# Altium schematic sheet NetworkSwitch.SchDoc: Main Flight Computer Ethernet Switch
size A2; Revision: 1A; SheetNumber: 3; SheetTotal: 7; Organization: Altium Limited; Address1: Matthew Glazer; Address2: Design Engineer
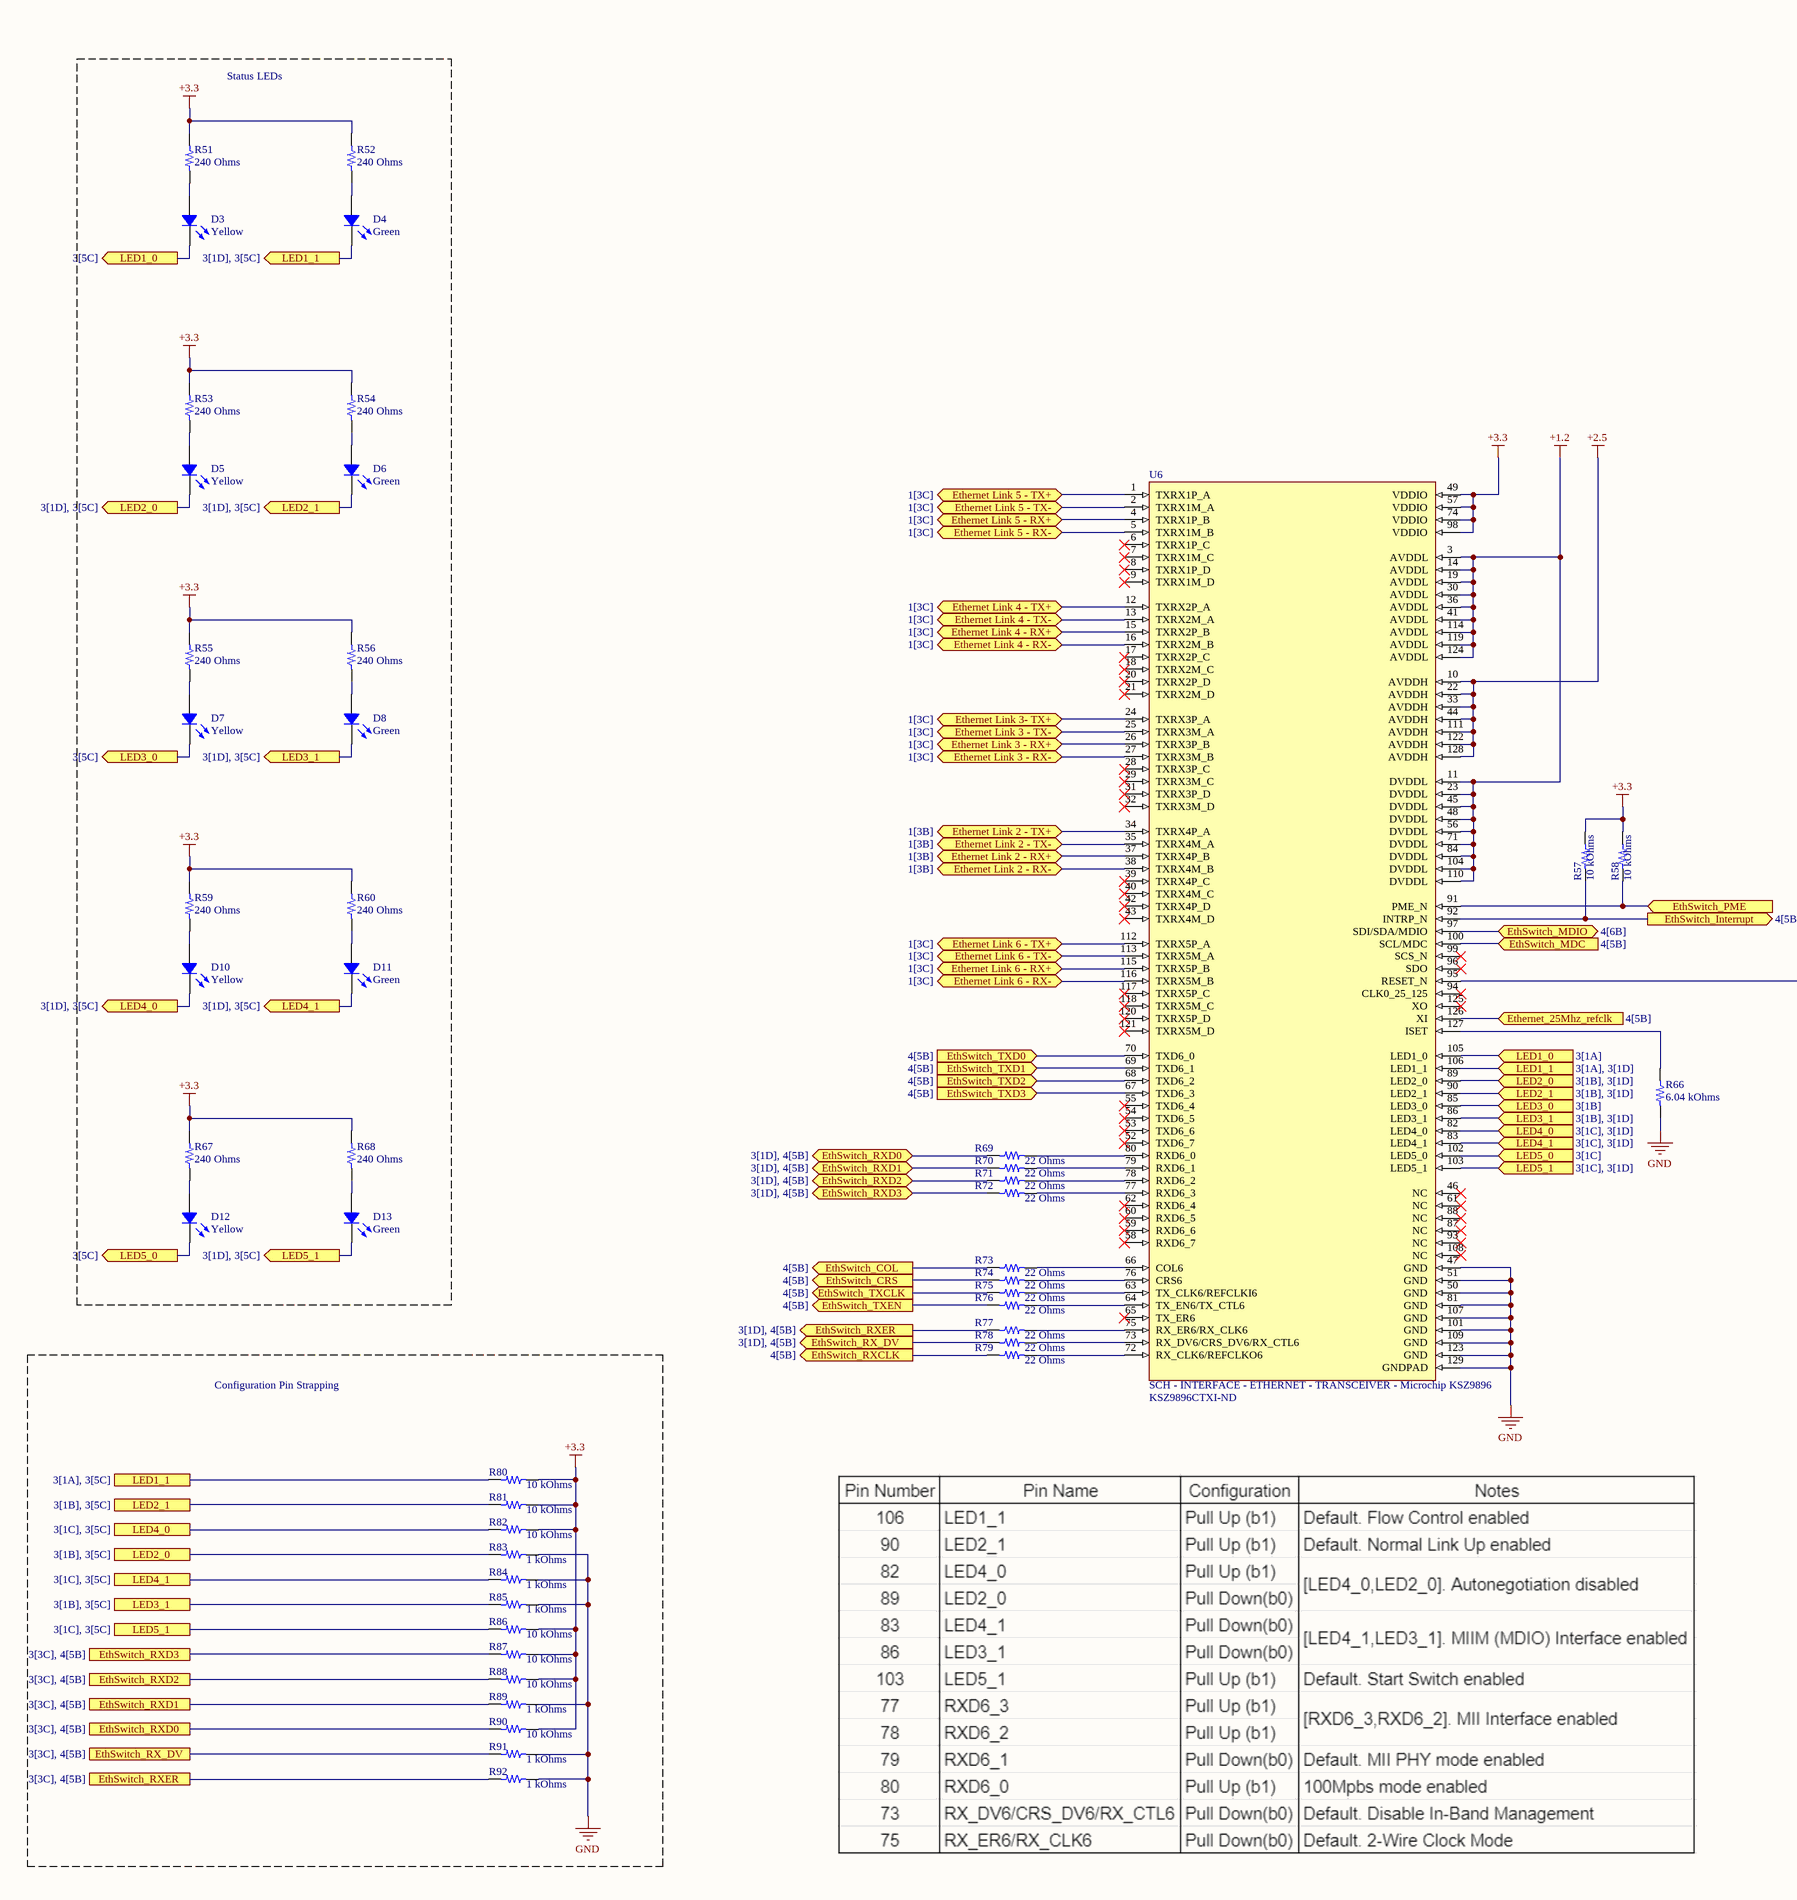
[diagram p0: NetworkSwitch.SchDoc, left]
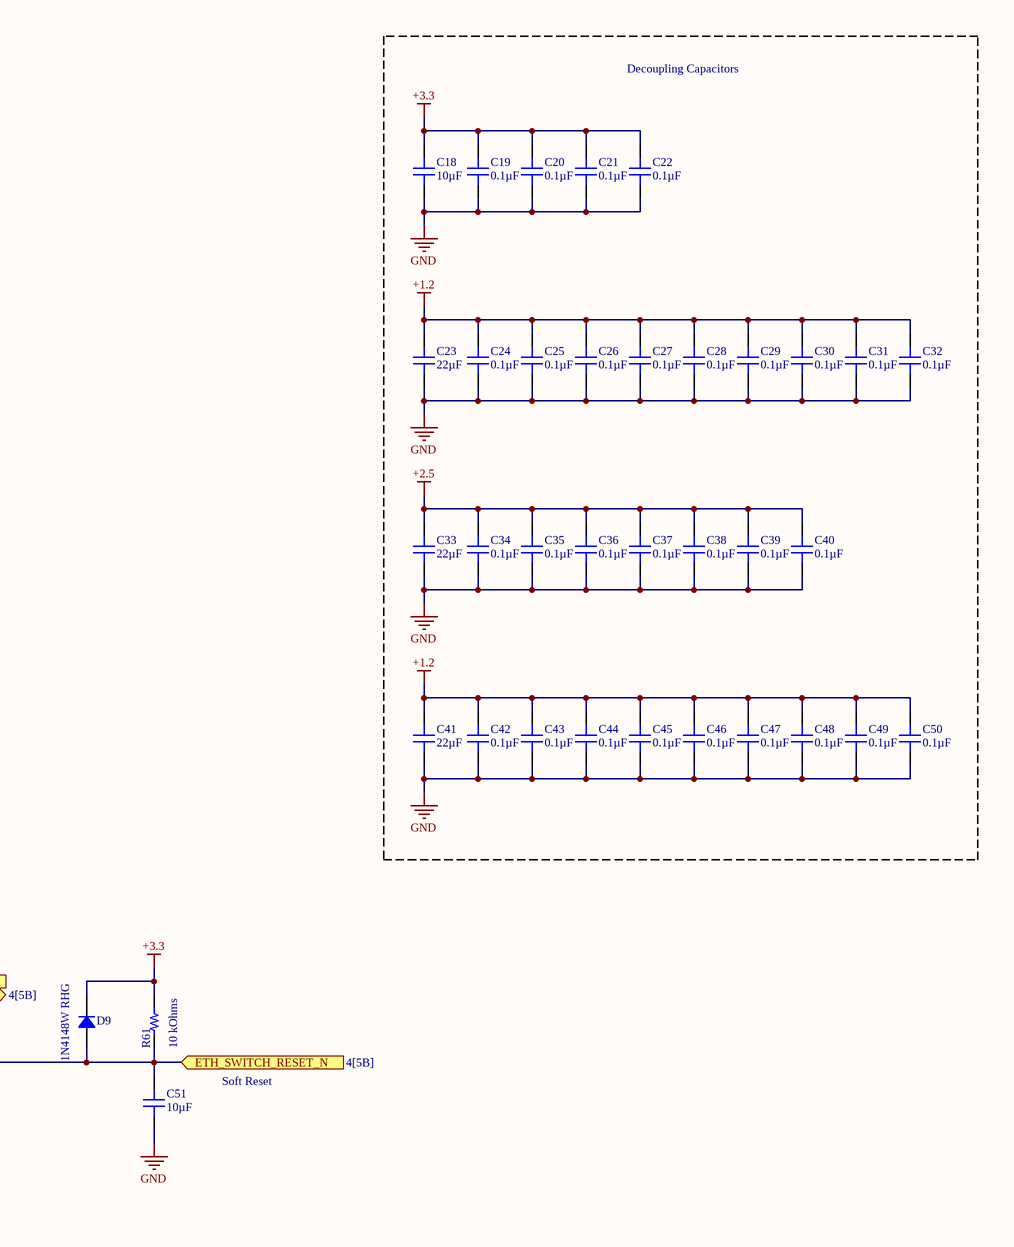
[diagram p1: NetworkSwitch.SchDoc, right]

## Parts
C18  10µF  [CAP 0805_2012]
C19  0.1µF  [CAP 0603_1608]
C20  0.1µF  [CAP 0603_1608]
C21  0.1µF  [CAP 0603_1608]
C22  0.1µF  [CAP 0603_1608]
C23  22µF  [CAP 0805_2012]
C24  0.1µF  [CAP 0603_1608]
C25  0.1µF  [CAP 0603_1608]
C26  0.1µF  [CAP 0603_1608]
C27  0.1µF  [CAP 0603_1608]
C28  0.1µF  [CAP 0603_1608]
C29  0.1µF  [CAP 0603_1608]
C30  0.1µF  [CAP 0603_1608]
C31  0.1µF  [CAP 0603_1608]
C32  0.1µF  [CAP 0603_1608]
C33  22µF  [CAP 0805_2012]
C34  0.1µF  [CAP 0603_1608]
C35  0.1µF  [CAP 0603_1608]
C36  0.1µF  [CAP 0603_1608]
C37  0.1µF  [CAP 0603_1608]
C38  0.1µF  [CAP 0603_1608]
C39  0.1µF  [CAP 0603_1608]
C40  0.1µF  [CAP 0603_1608]
C41  22µF  [CAP 0805_2012]
C42  0.1µF  [CAP 0603_1608]
C43  0.1µF  [CAP 0603_1608]
C44  0.1µF  [CAP 0603_1608]
C45  0.1µF  [CAP 0603_1608]
C46  0.1µF  [CAP 0603_1608]
C47  0.1µF  [CAP 0603_1608]
C48  0.1µF  [CAP 0603_1608]
C49  0.1µF  [CAP 0603_1608]
C50  0.1µF  [CAP 0603_1608]
C51  10µF  [CAP 0805_2012]
D3  Yellow  [LED 0603_1608 YELLOW]
D4  Green  [LED 0603_1608 GREEN]
D5  Yellow  [LED 0603_1608 YELLOW]
D6  Green  [LED 0603_1608 GREEN]
D7  Yellow  [LED 0603_1608 YELLOW]
D8  Green  [LED 0603_1608 GREEN]
D9  1N4148W RHG  [SOD123F]
D10  Yellow  [LED 0603_1608 YELLOW]
D11  Green  [LED 0603_1608 GREEN]
D12  Yellow  [LED 0603_1608 YELLOW]
D13  Green  [LED 0603_1608 GREEN]
R51  240 Ohms  [RES 0603_1608]
R52  240 Ohms  [RES 0603_1608]
R53  240 Ohms  [RES 0603_1608]
R54  240 Ohms  [RES 0603_1608]
R55  240 Ohms  [RES 0603_1608]
R56  240 Ohms  [RES 0603_1608]
R57  10 kOhms  [RES 0603_1608]
R58  10 kOhms  [RES 0603_1608]
R59  240 Ohms  [RES 0603_1608]
R60  240 Ohms  [RES 0603_1608]
R61  10 kOhms  [RES 0603_1608]
R66  6.04 kOhms  [RES 0603_1608]
R67  240 Ohms  [RES 0603_1608]
R68  240 Ohms  [RES 0603_1608]
R69  22 Ohms  [RES 0603_1608]
R70  22 Ohms  [RES 0603_1608]
R71  22 Ohms  [RES 0603_1608]
R72  22 Ohms  [RES 0603_1608]
R73  22 Ohms  [RES 0603_1608]
R74  22 Ohms  [RES 0603_1608]
R75  22 Ohms  [RES 0603_1608]
R76  22 Ohms  [RES 0603_1608]
R77  22 Ohms  [RES 0603_1608]
R78  22 Ohms  [RES 0603_1608]
R79  22 Ohms  [RES 0603_1608]
R80  10 kOhms  [RES 0603_1608]
R81  10 kOhms  [RES 0603_1608]
R82  10 kOhms  [RES 0603_1608]
R83  1 kOhms  [RES 0603_1608]
R84  1 kOhms  [RES 0603_1608]
R85  1 kOhms  [RES 0603_1608]
R86  10 kOhms  [RES 0603_1608]
R87  10 kOhms  [RES 0603_1608]
R88  10 kOhms  [RES 0603_1608]
R89  1 kOhms  [RES 0603_1608]
R90  10 kOhms  [RES 0603_1608]
R91  1 kOhms  [RES 0603_1608]
R92  1 kOhms  [RES 0603_1608]
U6  SCH - INTERFACE - ETHERNET - TRANSCEIVER - Microchip KSZ9896  Supplier Part Number 1: KSZ9896CTXI-ND  [PCB - LEADS - QFP - Microchip 128-TQFP]

## Blocks framed on the sheet
Status LEDs: D3-D8 D10-D13 R51-R56 R59 R60 R67 R68
Decoupling Capacitors: C18-C50
Configuration Pin Strapping: R80-R92

## Ports
ETH_SWITCH_RESET_N (in, see 4[5B]), Ethernet Link 2 - RX+ (bidir, see 1[3B]), Ethernet Link 2 - RX- (bidir, see 1[3B]), Ethernet Link 2 - TX+ (bidir, see 1[3B]), Ethernet Link 2 - TX- (bidir, see 1[3B]), Ethernet Link 3 - RX+ (bidir, see 1[3C]), Ethernet Link 3 - RX- (bidir, see 1[3C]), Ethernet Link 3 - TX- (bidir, see 1[3C]), Ethernet Link 3- TX+ (bidir, see 1[3C]), Ethernet Link 4 - RX+ (bidir, see 1[3C]), Ethernet Link 4 - RX- (bidir, see 1[3C]), Ethernet Link 4 - TX+ (bidir, see 1[3C]), Ethernet Link 4 - TX- (bidir, see 1[3C]), Ethernet Link 5 - RX+ (bidir, see 1[3C]), Ethernet Link 5 - RX- (bidir, see 1[3C]), Ethernet Link 5 - TX+ (bidir, see 1[3C]), Ethernet Link 5 - TX- (bidir, see 1[3C]), Ethernet Link 6 - RX+ (bidir, see 1[3C]), Ethernet Link 6 - RX- (bidir, see 1[3C]), Ethernet Link 6 - TX+ (bidir, see 1[3C]), Ethernet Link 6 - TX- (bidir, see 1[3C]), Ethernet_25Mhz_refclk (in, see 4[5B]), EthSwitch_COL (out, see 4[5B]), EthSwitch_CRS (out, see 4[5B]), EthSwitch_Interrupt (out, see 4[5B]), EthSwitch_MDC (in, see 4[5B]), EthSwitch_MDIO (bidir, see 4[6B]), EthSwitch_PME (in), EthSwitch_RX_DV (out, see 3[1D], 4[5B]), EthSwitch_RX_DV (see 3[3C], 4[5B]), EthSwitch_RXCLK (out, see 4[5B]), EthSwitch_RXD0 (bidir, see 3[1D], 4[5B]), EthSwitch_RXD0 (see 3[3C], 4[5B]), EthSwitch_RXD1 (bidir, see 3[1D], 4[5B]), EthSwitch_RXD1 (see 3[3C], 4[5B]), EthSwitch_RXD2 (bidir, see 3[1D], 4[5B]), EthSwitch_RXD2 (see 3[3C], 4[5B]), EthSwitch_RXD3 (bidir, see 3[1D], 4[5B]), EthSwitch_RXD3 (see 3[3C], 4[5B]), EthSwitch_RXER (out, see 3[1D], 4[5B]), EthSwitch_RXER (see 3[3C], 4[5B]), EthSwitch_TXCLK (out, see 4[5B]), EthSwitch_TXD0 (in, see 4[5B]), EthSwitch_TXD1 (in, see 4[5B]), EthSwitch_TXD2 (in, see 4[5B]), EthSwitch_TXD3 (in, see 4[5B]), EthSwitch_TXEN (out, see 4[5B]), LED1_0 (in, see 3[1A]), LED1_0 (out, see 3[5C]), LED1_1 (in, see 3[1A], 3[1D]), LED1_1 (out, see 3[1D], 3[5C]), LED1_1 (see 3[1A], 3[5C]), LED2_0 (in, see 3[1B], 3[1D]), LED2_0 (out, see 3[1D], 3[5C]), LED2_0 (see 3[1B], 3[5C]), LED2_1 (in, see 3[1B], 3[1D]), LED2_1 (out, see 3[1D], 3[5C]), LED2_1 (see 3[1B], 3[5C]), LED3_0 (in, see 3[1B]), LED3_0 (out, see 3[5C]), LED3_1 (in, see 3[1B], 3[1D]), LED3_1 (out, see 3[1D], 3[5C]), LED3_1 (see 3[1B], 3[5C]), LED4_0 (in, see 3[1C], 3[1D]), LED4_0 (out, see 3[1D], 3[5C]), LED4_0 (see 3[1C], 3[5C]), LED4_1 (in, see 3[1C], 3[1D]), LED4_1 (out, see 3[1D], 3[5C]), LED4_1 (see 3[1C], 3[5C]), LED5_0 (in, see 3[1C]), LED5_0 (out, see 3[5C]), LED5_1 (in, see 3[1C], 3[1D]), LED5_1 (out, see 3[1D], 3[5C]), LED5_1 (see 3[1C], 3[5C])

## Nets
+1.2: C23.2 C24.2 C25.2 C26.2 C27.2 C28.2 C29.2 C30.2 C31.2 C32.2 C41.2 C42.2 C43.2 C44.2 C45.2 C46.2 C47.2 C48.2 C49.2 C50.2 U6.3(AVDDL) U6.11(DVDDL) U6.14(AVDDL) U6.19(AVDDL) U6.23(DVDDL) U6.30(AVDDL) U6.36(AVDDL) U6.41(AVDDL) U6.45(DVDDL) U6.48(DVDDL) U6.56(DVDDL) U6.71(DVDDL) U6.84(DVDDL) U6.104(DVDDL) U6.110(DVDDL) U6.114(AVDDL) U6.119(AVDDL) U6.124(AVDDL)
+2.5: C33.2 C34.2 C35.2 C36.2 C37.2 C38.2 C39.2 C40.2 U6.10(AVDDH) U6.22(AVDDH) U6.33(AVDDH) U6.44(AVDDH) U6.111(AVDDH) U6.122(AVDDH) U6.128(AVDDH)
+3.3: C18.2 C19.2 C20.2 C21.2 C22.2 D9.2 R51.2 R52.2 R53.2 R54.2 R55.2 R56.2 R57.2 R58.2 R59.2 R60.2 R61.2 R67.2 R68.2 R80.1 R81.1 R82.1 R86.1 R87.1 R88.1 R90.1 U6.49(VDDIO) U6.57(VDDIO) U6.74(VDDIO) U6.98(VDDIO)
GND: C18.1 C19.1 C20.1 C21.1 C22.1 C23.1 C24.1 C25.1 C26.1 C27.1 C28.1 C29.1 C30.1 C31.1 C32.1 C33.1 C34.1 C35.1 C36.1 C37.1 C38.1 C39.1 C40.1 C41.1 C42.1 C43.1 C44.1 C45.1 C46.1 C47.1 C48.1 C49.1 C50.1 C51.1 R66.1 R83.1 R84.1 R85.1 R89.1 R91.1 R92.1 U6.47(GND) U6.50(GND) U6.51(GND) U6.81(GND) U6.101(GND) U6.107(GND) U6.109(GND) U6.123(GND) U6.129(GNDPAD)
ETH_SWITCH_RESET_N: C51.2 D9.1 R61.1 U6.95(RESET_N) ; port ETH_SWITCH_RESET_N
Ethernet Link 2 - RX+: U6.37(TXRX4P_B) ; port Ethernet Link 2 - RX+
Ethernet Link 2 - RX-: U6.38(TXRX4M_B) ; port Ethernet Link 2 - RX-
Ethernet Link 2 - TX+: U6.34(TXRX4P_A) ; port Ethernet Link 2 - TX+
Ethernet Link 2 - TX-: U6.35(TXRX4M_A) ; port Ethernet Link 2 - TX-
Ethernet Link 3 - RX+: U6.26(TXRX3P_B) ; port Ethernet Link 3 - RX+
Ethernet Link 3 - RX-: U6.27(TXRX3M_B) ; port Ethernet Link 3 - RX-
Ethernet Link 3 - TX-: U6.25(TXRX3M_A) ; port Ethernet Link 3 - TX-
Ethernet Link 3- TX+: U6.24(TXRX3P_A) ; port Ethernet Link 3- TX+
Ethernet Link 4 - RX+: U6.15(TXRX2P_B) ; port Ethernet Link 4 - RX+
Ethernet Link 4 - RX-: U6.16(TXRX2M_B) ; port Ethernet Link 4 - RX-
Ethernet Link 4 - TX+: U6.12(TXRX2P_A) ; port Ethernet Link 4 - TX+
Ethernet Link 4 - TX-: U6.13(TXRX2M_A) ; port Ethernet Link 4 - TX-
Ethernet Link 5 - RX+: U6.4(TXRX1P_B) ; port Ethernet Link 5 - RX+
Ethernet Link 5 - RX-: U6.5(TXRX1M_B) ; port Ethernet Link 5 - RX-
Ethernet Link 5 - TX+: U6.1(TXRX1P_A) ; port Ethernet Link 5 - TX+
Ethernet Link 5 - TX-: U6.2(TXRX1M_A) ; port Ethernet Link 5 - TX-
Ethernet Link 6 - RX+: U6.115(TXRX5P_B) ; port Ethernet Link 6 - RX+
Ethernet Link 6 - RX-: U6.116(TXRX5M_B) ; port Ethernet Link 6 - RX-
Ethernet Link 6 - TX+: U6.112(TXRX5P_A) ; port Ethernet Link 6 - TX+
Ethernet Link 6 - TX-: U6.113(TXRX5M_A) ; port Ethernet Link 6 - TX-
Ethernet_25Mhz_refclk: U6.126(XI) ; port Ethernet_25Mhz_refclk
EthSwitch_COL: R73.1 ; port EthSwitch_COL
EthSwitch_CRS: R74.1 ; port EthSwitch_CRS
EthSwitch_Interrupt: R57.1 U6.92(INTRP_N) ; port EthSwitch_Interrupt
EthSwitch_MDC: U6.100(SCL/MDC) ; port EthSwitch_MDC
EthSwitch_MDIO: U6.97(SDI/SDA/MDIO) ; port EthSwitch_MDIO
EthSwitch_PME: R58.1 U6.91(PME_N) ; port EthSwitch_PME
EthSwitch_RX_DV: R78.1 R91.2 ; port EthSwitch_RX_DV
EthSwitch_RXCLK: R79.1 ; port EthSwitch_RXCLK
EthSwitch_RXD0: R69.1 R90.2 ; port EthSwitch_RXD0
EthSwitch_RXD1: R70.1 R89.2 ; port EthSwitch_RXD1
EthSwitch_RXD2: R71.1 R88.2 ; port EthSwitch_RXD2
EthSwitch_RXD3: R72.1 R87.2 ; port EthSwitch_RXD3
EthSwitch_RXER: R77.1 R92.2 ; port EthSwitch_RXER
EthSwitch_TXCLK: R75.1 ; port EthSwitch_TXCLK
EthSwitch_TXD0: U6.70(TXD6_0) ; port EthSwitch_TXD0
EthSwitch_TXD1: U6.69(TXD6_1) ; port EthSwitch_TXD1
EthSwitch_TXD2: U6.68(TXD6_2) ; port EthSwitch_TXD2
EthSwitch_TXD3: U6.67(TXD6_3) ; port EthSwitch_TXD3
EthSwitch_TXEN: R76.1 ; port EthSwitch_TXEN
LED1_0: D3.2 U6.105(LED1_0) ; port LED1_0
LED1_1: D4.2 R80.2 U6.106(LED1_1) ; port LED1_1
LED2_0: D5.2 R83.2 U6.89(LED2_0) ; port LED2_0
LED2_1: D6.2 R81.2 U6.90(LED2_1) ; port LED2_1
LED3_0: D7.2 U6.85(LED3_0) ; port LED3_0
LED3_1: D8.2 R85.2 U6.86(LED3_1) ; port LED3_1
LED4_0: D10.2 R82.2 U6.82(LED4_0) ; port LED4_0
LED4_1: D11.2 R84.2 U6.83(LED4_1) ; port LED4_1
LED5_0: D12.2 U6.102(LED5_0) ; port LED5_0
LED5_1: D13.2 R86.2 U6.103(LED5_1) ; port LED5_1
NetD3_1: D3.1 R51.1
NetD4_1: D4.1 R52.1
NetD5_1: D5.1 R53.1
NetD6_1: D6.1 R54.1
NetD7_1: D7.1 R55.1
NetD8_1: D8.1 R56.1
NetD10_1: D10.1 R59.1
NetD11_1: D11.1 R60.1
NetD12_1: D12.1 R67.1
NetD13_1: D13.1 R68.1
NetR66_2: R66.2 U6.127(ISET)
NetR69_2: R69.2 U6.80(RXD6_0)
NetR70_2: R70.2 U6.79(RXD6_1)
NetR71_2: R71.2 U6.78(RXD6_2)
NetR72_2: R72.2 U6.77(RXD6_3)
NetR73_2: R73.2 U6.66(COL6)
NetR74_2: R74.2 U6.76(CRS6)
NetR75_2: R75.2 U6.63(TX_CLK6/REFCLKI6)
NetR76_2: R76.2 U6.64(TX_EN6/TX_CTL6)
NetR77_2: R77.2 U6.75(RX_ER6/RX_CLK6)
NetR78_2: R78.2 U6.73(RX_DV6/CRS_DV6/RX_CTL6)
NetR79_2: R79.2 U6.72(RX_CLK6/REFCLKO6)

Not connected (* = marked no-connect by the designer): U6 6(TXRX1P_C)* 7(TXRX1M_C)* 8(TXRX1P_D)* 9(TXRX1M_D)* 17(TXRX2P_C)* 18(TXRX2M_C)* 20(TXRX2P_D)* 21(TXRX2M_D)* 28(TXRX3P_C)* 29(TXRX3M_C)* 31(TXRX3P_D)* 32(TXRX3M_D)* 39(TXRX4P_C)* 40(TXRX4M_C)* 42(TXRX4P_D)* 43(TXRX4M_D)* 46(NC)* 52(TXD6_7)* 53(TXD6_6)* 54(TXD6_5)* 55(TXD6_4)* 58(RXD6_7)* 59(RXD6_6)* 60(RXD6_5)* 61(NC)* 62(RXD6_4)* 65(TX_ER6)* 87(NC)* 88(NC)* 93(NC)* 94(CLK0_25_125)* 96(SDO)* 99(SCS_N)* 108(NC)* 117(TXRX5P_C)* 118(TXRX5M_C)* 120(TXRX5P_D)* 121(TXRX5M_D)* 125(XO)*

## Notes on the sheet
- Soft Reset
- Title
- Size:
- Date:
- File:
- A2
- Number:
- Time:
- Revision:
- Sheet
- of

## Library data of the parts
C18 C51 = CC0805KKX5R7BB106: CAP CER 10UF 16V X5R 0805; Manufacturer: Yageo; Tolerance: ±10%; Part Number: CC0805KKX5R7BB106; Value: 10µF; Applications: General Purpose; Capacitance: 10µF; ComponentLink1Description: Datasheet; ComponentLink1URL: https://www.yageo.com/upload/media/product/productsearch/datasheet/mlcc/UPY-GPHC_X5R_4V-to-50V_25.pdf; ComponentLink2Description: DigiKey Link; ComponentLink2URL: http://digikey.com/product-detail/en/yageo/CC0805KKX5R7BB106/311-1865-1-ND/5195767; Device Package: 0805 (2012 Metric); LastUpdated: 9/2/2020 1:04:30 AM; Lifecycle Status: Active; Minimum Order: 1; Mounting Type: Surface Mount, MLCC; Operating Temperature: -55°C ~ 85°C; Package / Case: 0805 (2012 Metric); Packaging: TapeAndReel; PartId: 8867; Part Status: Active; Price: 0.09; Series: CC; Size / Dimension: 0.079" L x 0.049" W (2.00mm x 1.25mm); Supplier 1: DigiKey; Supplier Part Number 1: 311-1865-1-ND; Temperature Coefficient: X5R; Thickness (Max): 0.057" (1.45mm); Voltage - Rated: 16V
C19-C22 C24-C32 C34-C40 C42-C50 = CL10B104KA8WPNC: CAP CER 0.1UF 25V X7R 0603; Manufacturer: Samsung Electro-Mechanics; Tolerance: ±10%; Part Number: CL10B104KA8WPNC; Value: 0.1µF; Applications: Automotive; Capacitance: 0.1µF; ComponentLink1Description: Datasheet; ComponentLink1URL: http://www.samsungsem.com/kr/support/product-search/mlcc/CL10B104KA8WPNC.jsp; ComponentLink2Description: DigiKey Link; ComponentLink2URL: http://digikey.com/product-detail/en/samsung-electro-mechanics/CL10B104KA8WPNC/1276-6717-1-ND/5961576; Device Package: 0603 (1608 Metric); Features: Open Mode; LastUpdated: 9/2/2020 1:03:30 AM; Lifecycle Status: Active; Minimum Order: 1; Mounting Type: Surface Mount, MLCC; Operating Temperature: -55°C ~ 125°C; Package / Case: 0603 (1608 Metric); Packaging: TapeAndReel; PartId: 5631; Part Status: Active; Price: 0.02; Ratings: AEC-Q200; Series: CL; Size / Dimension: 0.063" L x 0.031" W (1.60mm x 0.80mm); Supplier 1: DigiKey; Supplier Part Number 1: 1276-6717-1-ND; Temperature Coefficient: X7R; Thickness (Max): 0.035" (0.90mm); Voltage - Rated: 25V
C23 C33 C41 = CL21A226KPCLRNC: CAP CER 22UF 10V X5R 0805; Manufacturer: Samsung Electro-Mechanics; Tolerance: ±10%; Part Number: CL21A226KPCLRNC; Value: 22µF; Applications: General Purpose; Capacitance: 22µF; ComponentLink1Description: Datasheet; ComponentLink1URL: http://www.samsungsem.com/kr/support/product-search/mlcc/CL21A226KPCLRNC.jsp; ComponentLink2Description: DigiKey Link; ComponentLink2URL: http://digikey.com/product-detail/en/samsung-electro-mechanics/CL21A226KPCLRNC/1276-6786-1-ND/5961645; Device Package: 0805 (2012 Metric); Features: Low Profile; LastUpdated: 9/2/2020 1:04:38 AM; Lifecycle Status: Active; Minimum Order: 1; Mounting Type: Surface Mount, MLCC; Operating Temperature: -55°C ~ 85°C; Package / Case: 0805 (2012 Metric); Packaging: TapeAndReel; PartId: 4833; Part Status: Active; Price: 0.08; Series: CL; Size / Dimension: 0.079" L x 0.049" W (2.00mm x 1.25mm); Supplier 1: DigiKey; Supplier Part Number 1: 1276-6786-1-ND; Temperature Coefficient: X5R; Thickness (Max): 0.037" (0.95mm); Voltage - Rated: 10V
D3 D5 D7 D10 D12 = LTST-C191KSKT: LED YELLOW CLEAR SMD; Manufacturer: Lite-On Inc.; Configuration: Standard; Current - Test: 20mA; Lens Color: Colorless; Lens Size: 1.10mm x 0.80mm; Lens Style: Rectangle with Flat Top; Millicandela Rating: 104mcd; Viewing Angle: 130°; Voltage - Forward (Vf) (Typ): 2.1V; Wavelength - Dominant: 591nm; Wavelength - Peak: 588nm; Part Number: LTST-C191KSKT; Color: Yellow; ComponentLink1Description: Datasheet; ComponentLink1URL: http://optoelectronics.liteon.com/upload/download/DS22-2000-224/LTST-C191KSKT.PDF; ComponentLink2Description: DigiKey Link; ComponentLink2URL: http://digikey.com/product-detail/en/lite-on-inc/LTST-C191KSKT/160-1448-1-ND/386838; Device Package: 0603 (1608 Metric); Height (Max): 0.65mm; LastUpdated: 9/2/2020 1:21:17 AM; Lens Transparency: Clear; Lifecycle Status: Active; Minimum Order: 1; Mounting Type: Surface Mount; Package / Case: 0603 (1608 Metric); Packaging: TapeAndReel; PartId: 132; Part Status: Active; Price: 0.04; Series: -; Size / Dimension: 1.60mm L x 0.80mm W; Supplier 1: DigiKey; Supplier Part Number 1: 160-1448-1-ND; Value: Yellow
D4 D6 D8 D11 D13 = LTST-C193KGKT-5A: LED GREEN CLEAR CHIP SMD; Manufacturer: Lite-On Inc.; Configuration: Standard; Current - Test: 5mA; Lens Color: Colorless; Lens Size: 1.15mm x 0.80mm; Lens Style: Rectangle with Flat Top; Millicandela Rating: 16.25mcd; Viewing Angle: 130°; Voltage - Forward (Vf) (Typ): 2V; Wavelength - Dominant: 572nm; Wavelength - Peak: 574nm; Part Number: LTST-C193KGKT-5A; Color: Green; ComponentLink1Description: Datasheet; ComponentLink1URL: http://optoelectronics.liteon.com/upload/download/DS22-2007-0094/LTST-C193KGKT-5A.PDF; ComponentLink2Description: DigiKey Link; ComponentLink2URL: http://digikey.com/product-detail/en/lite-on-inc/LTST-C193KGKT-5A/160-1828-1-ND/2356247; Device Package: 0603 (1608 Metric); Height (Max): 0.45mm; LastUpdated: 9/2/2020 1:20:41 AM; Lens Transparency: Clear; Lifecycle Status: Active; Minimum Order: 1; Mounting Type: Surface Mount; Package / Case: 0603 (1608 Metric); Packaging: TapeAndReel; PartId: 694; Part Status: Active; Price: 0.06; Series: -; Size / Dimension: 1.60mm L x 0.80mm W; Supplier 1: DigiKey; Supplier Part Number 1: 160-1828-1-ND; Supplier Device Package: Chip LED; Value: Green
D9 = 1N4148W RHG: DIODE GEN PURP 100V 150MA SOD123; Manufacturer: Taiwan Semiconductor Corporation; Current - Average Rectified (Io): 150mA (DC); Current - Reverse Leakage @ Vr: 5µA @ 75V; Diode Type: Standard; Reverse Recovery Time (trr): 4ns; Speed: Fast Recovery =< 500ns, > 200mA (Io); Voltage - Forward (Vf) (Max) @ If: 1V @ 100mA; Part Number: 1N4148W RHG; ComponentLink1Description: Datasheet; ComponentLink1URL: https://www.taiwansemi.com/products/datasheet/1N4148W%20SERIES_K1804.pdf; ComponentLink2Description: DigiKey Link; ComponentLink2URL: http://digikey.com/product-detail/en/taiwan-semiconductor-corporation/1N4148W-RHG/1N4148WRHGCT-ND/7357066; LastUpdated: 9/2/2020 1:19:10 AM; Lifecycle Status: Active; Minimum Order: 1; Mounting Type: Surface Mount; Operating Temperature - Junction: -65°C ~ 150°C; Package / Case: SOD-123F; Packaging: TapeAndReel; PartId: 1073; Part Status: Active; Price: 0.03; Series: -; Supplier 1: DigiKey; Supplier Part Number 1: 1N4148WRHGCT-ND; Supplier Device Package: SOD-123F; Voltage - DC Reverse (Vr) (Max): 100V
R51-R56 R59 R60 R67 R68 = RMCF0603JT240R: RES 240 OHM 5% 1/10W 0603; Manufacturer: Stackpole Electronics Inc; Power (Watts): 0.1W, 1/10W; Temperature Coefficient: ±200ppm/°C; Part Number: RMCF0603JT240R; Value: 240 Ohms; ComponentLink1Description: Datasheet; ComponentLink1URL: https://www.seielect.com/catalog/sei-rmcf_rmcp.pdf; ComponentLink2Description: DigiKey Link; ComponentLink2URL: http://digikey.com/product-detail/en/stackpole-electronics-inc/RMCF0603JT240R/RMCF0603JT240RCT-ND/2418189; Composition: Thick Film; Device Package: 0603 (1608 Metric); Features: Automotive AEC-Q200; Height - Seated (Max): 0.022" (0.55mm); LastUpdated: 9/2/2020 1:10:22 AM; Lifecycle Status: Active; Minimum Order: 1; Number of Terminations: 2; Operating Temperature: -55°C ~ 155°C; Package / Case: 0603 (1608 Metric); Packaging: CutTape; PartId: 5995; Part Status: Active; Price: 0.10; Ratings: AEC-Q200; Resistance: 240 Ohms; Series: RMCF; Size / Dimension: 0.061" L x 0.031" W (1.55mm x 0.80mm); Supplier 1: DigiKey; Supplier Part Number 1: RMCF0603JT240RCT-ND; Supplier Device Package: 0603; Tolerance: ±5%
R57 R58 R61 R80-R82 R86-R88 R90 = RMCF0603JT10K0: RES 10K OHM 5% 1/10W 0603; Manufacturer: Stackpole Electronics Inc; Power (Watts): 0.1W, 1/10W; Temperature Coefficient: ±200ppm/°C; Part Number: RMCF0603JT10K0; Value: 10 kOhms; ComponentLink1Description: Datasheet; ComponentLink1URL: https://www.seielect.com/catalog/sei-packaging.pdf; ComponentLink2Description: DigiKey Link; ComponentLink2URL: http://digikey.com/product-detail/en/stackpole-electronics-inc/RMCF0603JT10K0/RMCF0603JT10K0CT-ND/1943191; Composition: Thick Film; Device Package: 0603 (1608 Metric); Features: Automotive AEC-Q200; Height - Seated (Max): 0.022" (0.55mm); LastUpdated: 9/2/2020 1:09:31 AM; Lifecycle Status: Active; Minimum Order: 1; Number of Terminations: 2; Operating Temperature: -55°C ~ 155°C; Package / Case: 0603 (1608 Metric); Packaging: CutTape; PartId: 25659; Part Status: Active; Price: 0.10; Ratings: AEC-Q200; Resistance: 10 kOhms; Series: RMCF; Size / Dimension: 0.061" L x 0.031" W (1.55mm x 0.80mm); Supplier 1: DigiKey; Supplier Part Number 1: RMCF0603JT10K0CT-ND; Supplier Device Package: 0603; Tolerance: ±5%
R66 = RMCF0603FT6K04: RES 6.04K OHM 1% 1/10W 0603; Manufacturer: Stackpole Electronics Inc; Power (Watts): 0.1W, 1/10W; Temperature Coefficient: ±100ppm/°C; Part Number: RMCF0603FT6K04; Value: 6.04 kOhms; ComponentLink1Description: Datasheet; ComponentLink1URL: https://www.seielect.com/catalog/sei-rmcf_rmcp.pdf; ComponentLink2Description: DigiKey Link; ComponentLink2URL: http://digikey.com/product-detail/en/stackpole-electronics-inc/RMCF0603FT6K04/RMCF0603FT6K04CT-ND/1943041; Composition: Thick Film; Device Package: 0603 (1608 Metric); Features: Automotive AEC-Q200; Height - Seated (Max): 0.022" (0.55mm); LastUpdated: 9/2/2020 1:10:13 AM; Lifecycle Status: Active; Minimum Order: 1; Number of Terminations: 2; Operating Temperature: -55°C ~ 155°C; Package / Case: 0603 (1608 Metric); Packaging: CutTape; PartId: 10873; Part Status: Active; Price: 0.10; Ratings: AEC-Q200; Resistance: 6.04 kOhms; Series: RMCF; Size / Dimension: 0.061" L x 0.031" W (1.55mm x 0.80mm); Supplier 1: DigiKey; Supplier Part Number 1: RMCF0603FT6K04CT-ND; Supplier Device Package: 0603; Tolerance: ±1%
R69-R79 = RMCF0603FT22R0: RES 22 OHM 1% 1/10W 0603; Manufacturer: Stackpole Electronics Inc; Power (Watts): 0.1W, 1/10W; Temperature Coefficient: ±100ppm/°C; Part Number: RMCF0603FT22R0; Value: 22 Ohms; ComponentLink1Description: Datasheet; ComponentLink1URL: https://www.seielect.com/catalog/sei-packaging.pdf; ComponentLink2Description: DigiKey Link; ComponentLink2URL: http://digikey.com/product-detail/en/stackpole-electronics-inc/RMCF0603FT22R0/RMCF0603FT22R0CT-ND/1942946; Composition: Thick Film; Device Package: 0603 (1608 Metric); Features: Automotive AEC-Q200; Height - Seated (Max): 0.022" (0.55mm); LastUpdated: 9/2/2020 1:10:13 AM; Lifecycle Status: Active; Minimum Order: 1; Number of Terminations: 2; Operating Temperature: -55°C ~ 155°C; Package / Case: 0603 (1608 Metric); Packaging: CutTape; PartId: 10611; Part Status: Active; Price: 0.10; Ratings: AEC-Q200; Resistance: 22 Ohms; Series: RMCF; Size / Dimension: 0.061" L x 0.031" W (1.55mm x 0.80mm); Supplier 1: DigiKey; Supplier Part Number 1: RMCF0603FT22R0CT-ND; Supplier Device Package: 0603; Tolerance: ±1%
R83-R85 R89 R91 R92 = RNCP0603FTD1K00: RES 1K OHM 1% 1/8W 0603; Manufacturer: Stackpole Electronics Inc; Power (Watts): 0.125W, 1/8W; Temperature Coefficient: ±100ppm/°C; Part Number: RNCP0603FTD1K00; Value: 1 kOhms; ComponentLink1Description: Datasheet; ComponentLink1URL: https://www.seielect.com/catalog/sei-rncp.pdf; ComponentLink2Description: DigiKey Link; ComponentLink2URL: http://digikey.com/product-detail/en/stackpole-electronics-inc/RNCP0603FTD1K00/RNCP0603FTD1K00CT-ND/2240445; Composition: Thin Film; Device Package: 0603 (1608 Metric); Features: Anti-Sulfur, Moisture Resistant; Height - Seated (Max): 0.020" (0.50mm); LastUpdated: 9/2/2020 1:10:23 AM; Lifecycle Status: Active; Minimum Order: 1; Number of Terminations: 2; Operating Temperature: -55°C ~ 155°C; Package / Case: 0603 (1608 Metric); Packaging: TapeAndReel; PartId: 5694; Part Status: Active; Price: 0.01; Resistance: 1 kOhms; Series: RNCP; Size / Dimension: 0.059" L x 0.031" W (1.50mm x 0.80mm); Supplier 1: DigiKey; Supplier Part Number 1: RNCP0603FTD1K00CT-ND; Supplier Device Package: 0603; Tolerance: ±1%
U6 = SCH - INTERFACE - ETHERNET - TRANSCEIVER - Microchip KSZ9896: Supplier 1: Digi-Key